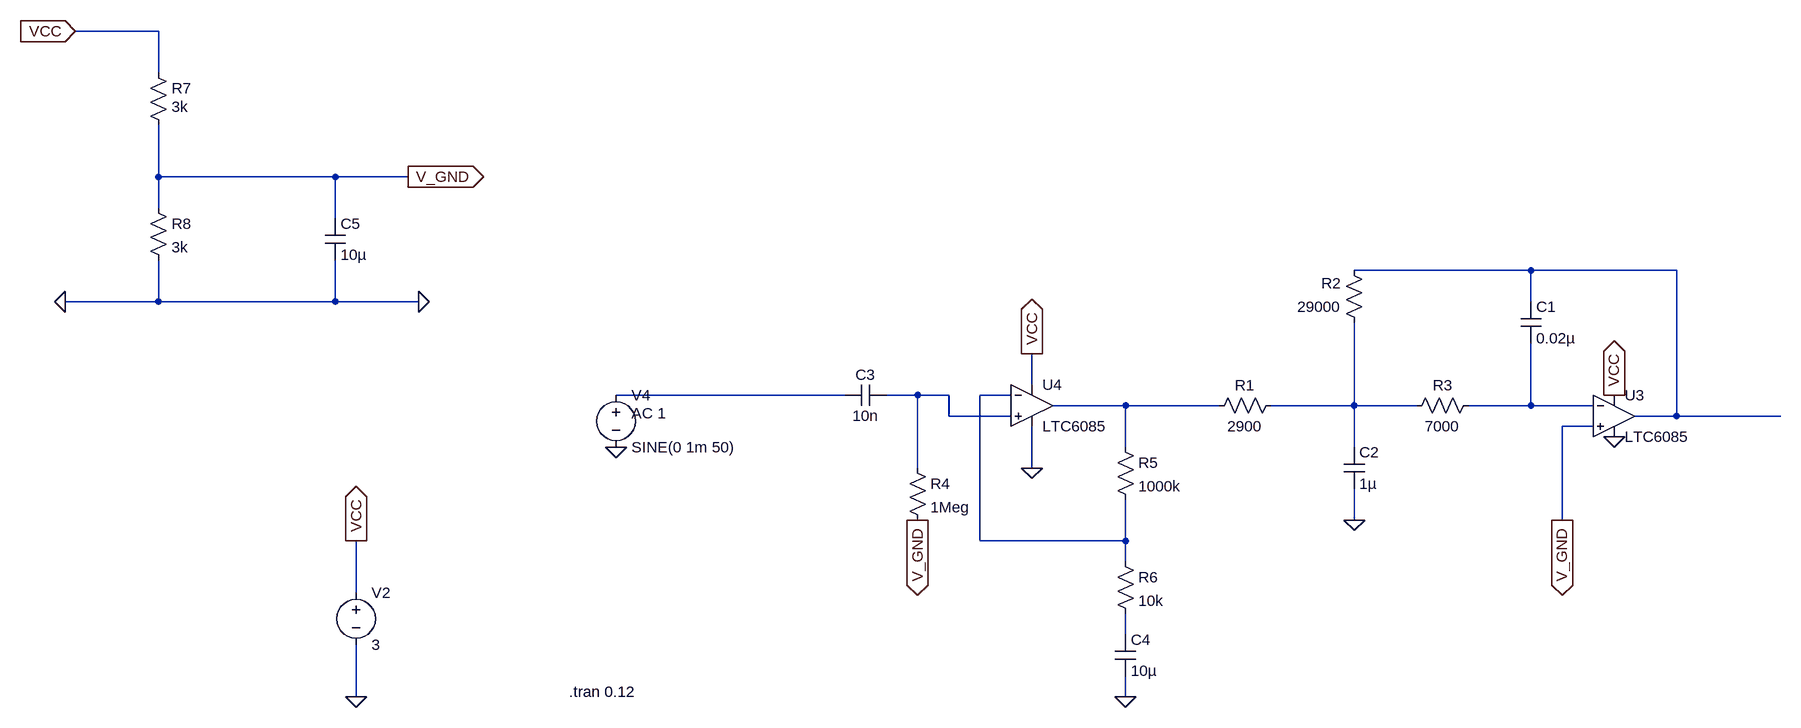
[diagram p0: schematic Schema_Cable_Monitor_LTSpice.asc]
Schema_Cable_Monitor_LTSpice.asc, the LTspice schematic file:
Version 4
SHEET 1 3036 680
WIRE -944 -1120 -1072 -1120
WIRE -944 -1056 -944 -1120
WIRE -944 -896 -944 -976
WIRE -672 -896 -944 -896
WIRE -560 -896 -672 -896
WIRE -944 -848 -944 -896
WIRE -672 -832 -672 -896
WIRE 1168 -752 896 -752
WIRE 1392 -752 1168 -752
WIRE -944 -704 -944 -768
WIRE -944 -704 -1088 -704
WIRE -672 -704 -672 -768
WIRE -672 -704 -944 -704
WIRE -544 -704 -672 -704
WIRE 1168 -704 1168 -752
WIRE 400 -576 400 -624
WIRE 112 -560 -240 -560
WIRE 224 -560 176 -560
WIRE 272 -560 224 -560
WIRE 368 -560 320 -560
WIRE 544 -544 432 -544
WIRE 688 -544 544 -544
WIRE 896 -544 896 -672
WIRE 896 -544 768 -544
WIRE 992 -544 896 -544
WIRE 1168 -544 1168 -640
WIRE 1168 -544 1072 -544
WIRE 1264 -544 1168 -544
WIRE 272 -528 272 -560
WIRE 368 -528 272 -528
WIRE 1392 -528 1392 -752
WIRE 1392 -528 1328 -528
WIRE 1552 -528 1392 -528
WIRE 1264 -512 1216 -512
WIRE 544 -480 544 -544
WIRE 896 -480 896 -544
WIRE 224 -448 224 -560
WIRE 400 -448 400 -512
WIRE 896 -368 896 -416
WIRE 1216 -368 1216 -512
WIRE 320 -336 320 -560
WIRE 544 -336 544 -400
WIRE 544 -336 320 -336
WIRE 544 -304 544 -336
WIRE -640 -256 -640 -336
WIRE 544 -192 544 -224
WIRE -640 -96 -640 -176
WIRE 544 -96 544 -128
FLAG 896 -368 0
FLAG -640 -96 0
FLAG 544 -96 0
FLAG 400 -448 0
FLAG -640 -336 VCC
IOPIN -640 -336 Out
FLAG 1296 -560 VCC
IOPIN 1296 -560 Out
FLAG 1296 -496 0
FLAG -240 -480 0
FLAG 400 -624 VCC
IOPIN 400 -624 Out
FLAG -544 -704 0
FLAG -1088 -704 0
FLAG -560 -896 V_GND
IOPIN -560 -896 Out
FLAG 224 -368 V_GND
IOPIN 224 -368 Out
FLAG -1072 -1120 VCC
IOPIN -1072 -1120 In
FLAG 1216 -368 V_GND
IOPIN 1216 -368 Out
SYMBOL voltage -640 -272 R0
SYMATTR InstName V2
SYMATTR Value 3
SYMBOL cap 176 -576 R90
WINDOW 0 0 32 VBottom 2
WINDOW 3 32 32 VTop 2
SYMATTR InstName C3
SYMATTR Value 10n
SYMBOL res 208 -464 R0
SYMATTR InstName R4
SYMATTR Value 1Meg
SYMBOL res 528 -496 R0
SYMATTR InstName R5
SYMATTR Value 1000k
SYMBOL res 528 -320 R0
SYMATTR InstName R6
SYMATTR Value 10k
SYMBOL cap 528 -192 R0
SYMATTR InstName C4
SYMATTR Value 10µ
SYMBOL Opamps\\LTC6085 1296 -528 R0
SYMATTR InstName U3
SYMBOL Opamps\\LTC6085 400 -544 R0
SYMATTR InstName U4
SYMBOL voltage -240 -576 R0
WINDOW 123 24 44 Left 2
WINDOW 39 0 0 Left 2
SYMATTR Value2 AC 1
SYMATTR InstName V4
SYMATTR Value SINE(0 1m 50)
SYMBOL res -960 -1072 R0
WINDOW 3 36 68 Left 2
SYMATTR Value 3k
SYMATTR InstName R7
SYMBOL res -960 -864 R0
SYMATTR InstName R8
SYMATTR Value 3k
SYMBOL cap -688 -832 R0
SYMATTR InstName C5
SYMATTR Value 10µ
SYMBOL cap 1152 -704 R0
SYMATTR InstName C1
SYMATTR Value 0.02µ
SYMBOL cap 880 -480 R0
SYMATTR InstName C2
SYMATTR Value 1µ
SYMBOL res 784 -560 R90
WINDOW 0 0 56 VBottom 2
WINDOW 3 32 56 VTop 2
SYMATTR InstName R1
SYMATTR Value 2900
SYMBOL res 912 -656 R180
WINDOW 0 36 76 Left 2
WINDOW 3 36 40 Left 2
SYMATTR InstName R2
SYMATTR Value 29000
SYMBOL res 976 -528 R270
WINDOW 0 32 56 VTop 2
WINDOW 3 0 56 VBottom 2
SYMATTR InstName R3
SYMATTR Value 7000
TEXT -312 -104 Left 2 !.tran 0.12

The netlist it stands for:
* Schema_Cable_Monitor_LTSpice.asc
V2 VCC 0 3
C3 N003 N002 10n
R4 N003 V_GND 1Meg
R5 N005 N004 1000k
R6 N004 N008 10k
C4 N008 0 10µ
* U3: LTC6085 (symbol Opamps\LTC6085 not available, pins judged from their places): In+=V_GND In-=N007 V+=VCC V-=0 OUT=N001
* U4: LTC6085 (symbol Opamps\LTC6085 not available, pins judged from their places): In+=N003 In-=N004 V+=VCC V-=0 OUT=N005
V4 N002 0 SINE(0 1m 50) AC 1
R7 VCC V_GND 3k
R8 V_GND 0 3k
C5 V_GND 0 10µ
C1 N001 N007 0.02µ
C2 N006 0 1µ
R1 N006 N005 2900
R2 N006 N001 29000
R3 N006 N007 7000
.tran 0.12
.backanno
.end